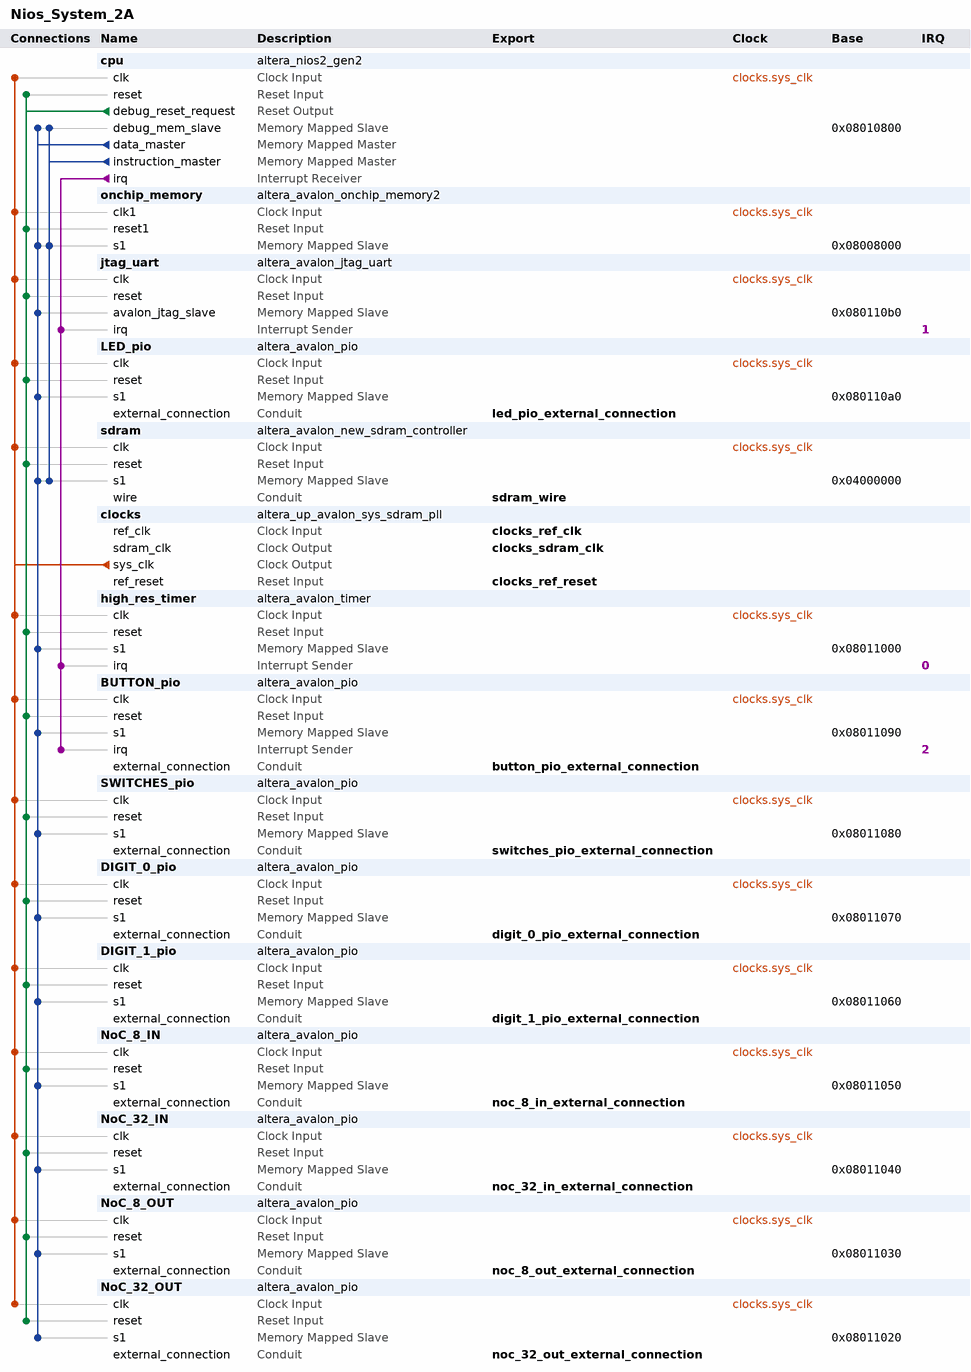
[diagram p0: system contents]
# Platform Designer (Qsys) system Nios_System_2A, Cyclone V 5CSEMA5F31C6
# Parameters at their usual value, and those the tool derives, are not listed.
package require -exact qsys 18.1
create_system Nios_System_2A
set_project_property DEVICE_FAMILY {Cyclone V}
set_project_property DEVICE 5CSEMA5F31C6

add_instance cpu altera_nios2_gen2 18.1
set_instance_parameter_value cpu cpuID 1
set_instance_parameter_value cpu dcache_size 8192
set_instance_parameter_value cpu exceptionSlave sdram.s1
set_instance_parameter_value cpu icache_size 4096
set_instance_parameter_value cpu impl Fast
set_instance_parameter_value cpu resetSlave sdram.s1

add_instance onchip_memory altera_avalon_onchip_memory2 18.1
set_instance_parameter_value onchip_memory dataWidth 32
set_instance_parameter_value onchip_memory dualPort false
set_instance_parameter_value onchip_memory initMemContent true
set_instance_parameter_value onchip_memory initializationFileName onchip_mem.hex
set_instance_parameter_value onchip_memory memorySize 20480

add_instance jtag_uart altera_avalon_jtag_uart 18.1
set_instance_parameter_value jtag_uart simInteractiveOptions NO_INTERACTIVE_WINDOWS

add_instance LED_pio altera_avalon_pio 18.1
set_instance_parameter_value LED_pio direction Output
set_instance_parameter_value LED_pio width 10

add_instance sdram altera_avalon_new_sdram_controller 18.1
set_instance_parameter_value sdram TAC 5.4
set_instance_parameter_value sdram TRCD 15.0
set_instance_parameter_value sdram TRP 15.0
set_instance_parameter_value sdram casLatency 3
set_instance_parameter_value sdram columnWidth 10
set_instance_parameter_value sdram dataWidth 16
set_instance_parameter_value sdram generateSimulationModel false
set_instance_parameter_value sdram model single_Micron_MT48LC4M32B2_7_chip
set_instance_parameter_value sdram numberOfBanks 4
set_instance_parameter_value sdram numberOfChipSelects 1
set_instance_parameter_value sdram powerUpDelay 100.0
set_instance_parameter_value sdram refreshPeriod 7.8125
set_instance_parameter_value sdram rowWidth 13

add_instance clocks altera_up_avalon_sys_sdram_pll 18.0
set_instance_parameter_value clocks CV_boards DE1-SoC
set_instance_parameter_value clocks gui_outclk 50.0
set_instance_parameter_value clocks gui_refclk 50.0

add_instance high_res_timer altera_avalon_timer 18.1
set_instance_parameter_value high_res_timer period 1
set_instance_parameter_value high_res_timer periodUnits MSEC

add_instance BUTTON_pio altera_avalon_pio 18.1
set_instance_parameter_value BUTTON_pio captureEdge true
set_instance_parameter_value BUTTON_pio direction Input
set_instance_parameter_value BUTTON_pio generateIRQ true
set_instance_parameter_value BUTTON_pio irqType EDGE
set_instance_parameter_value BUTTON_pio width 4

add_instance SWITCHES_pio altera_avalon_pio 18.1
set_instance_parameter_value SWITCHES_pio direction Input
set_instance_parameter_value SWITCHES_pio width 10

add_instance DIGIT_0_pio altera_avalon_pio 18.1
set_instance_parameter_value DIGIT_0_pio direction Output
set_instance_parameter_value DIGIT_0_pio width 7

add_instance DIGIT_1_pio altera_avalon_pio 18.1
set_instance_parameter_value DIGIT_1_pio direction Output
set_instance_parameter_value DIGIT_1_pio width 7

add_instance NoC_8_IN altera_avalon_pio 18.1
set_instance_parameter_value NoC_8_IN direction Input
set_instance_parameter_value NoC_8_IN width 8

add_instance NoC_32_IN altera_avalon_pio 18.1
set_instance_parameter_value NoC_32_IN direction Input
set_instance_parameter_value NoC_32_IN width 32

add_instance NoC_8_OUT altera_avalon_pio 18.1
set_instance_parameter_value NoC_8_OUT direction Output
set_instance_parameter_value NoC_8_OUT width 8

add_instance NoC_32_OUT altera_avalon_pio 18.1
set_instance_parameter_value NoC_32_OUT direction Output
set_instance_parameter_value NoC_32_OUT width 32

# connections
add_connection clocks.sys_clk BUTTON_pio.clk clock
add_connection clocks.sys_clk cpu.clk clock
add_connection clocks.sys_clk DIGIT_0_pio.clk clock
add_connection clocks.sys_clk DIGIT_1_pio.clk clock
add_connection clocks.sys_clk high_res_timer.clk clock
add_connection clocks.sys_clk jtag_uart.clk clock
add_connection clocks.sys_clk LED_pio.clk clock
add_connection clocks.sys_clk NoC_8_IN.clk clock
add_connection clocks.sys_clk NoC_8_OUT.clk clock
add_connection clocks.sys_clk NoC_32_IN.clk clock
add_connection clocks.sys_clk NoC_32_OUT.clk clock
add_connection clocks.sys_clk onchip_memory.clk1 clock
add_connection clocks.sys_clk sdram.clk clock
add_connection clocks.sys_clk SWITCHES_pio.clk clock
add_connection cpu.debug_reset_request BUTTON_pio.reset reset
add_connection cpu.debug_reset_request cpu.reset reset
add_connection cpu.debug_reset_request DIGIT_0_pio.reset reset
add_connection cpu.debug_reset_request DIGIT_1_pio.reset reset
add_connection cpu.debug_reset_request high_res_timer.reset reset
add_connection cpu.debug_reset_request jtag_uart.reset reset
add_connection cpu.debug_reset_request LED_pio.reset reset
add_connection cpu.debug_reset_request NoC_8_IN.reset reset
add_connection cpu.debug_reset_request NoC_8_OUT.reset reset
add_connection cpu.debug_reset_request NoC_32_IN.reset reset
add_connection cpu.debug_reset_request NoC_32_OUT.reset reset
add_connection cpu.debug_reset_request onchip_memory.reset1 reset
add_connection cpu.debug_reset_request sdram.reset reset
add_connection cpu.debug_reset_request SWITCHES_pio.reset reset
add_connection cpu.data_master BUTTON_pio.s1 avalon
set_connection_parameter_value cpu.data_master/BUTTON_pio.s1 baseAddress 0x08011090
add_connection cpu.data_master cpu.debug_mem_slave avalon
set_connection_parameter_value cpu.data_master/cpu.debug_mem_slave baseAddress 0x08010800
add_connection cpu.data_master DIGIT_0_pio.s1 avalon
set_connection_parameter_value cpu.data_master/DIGIT_0_pio.s1 baseAddress 0x08011070
add_connection cpu.data_master DIGIT_1_pio.s1 avalon
set_connection_parameter_value cpu.data_master/DIGIT_1_pio.s1 baseAddress 0x08011060
add_connection cpu.data_master high_res_timer.s1 avalon
set_connection_parameter_value cpu.data_master/high_res_timer.s1 baseAddress 0x08011000
add_connection cpu.data_master jtag_uart.avalon_jtag_slave avalon
set_connection_parameter_value cpu.data_master/jtag_uart.avalon_jtag_slave baseAddress 0x080110b0
add_connection cpu.data_master LED_pio.s1 avalon
set_connection_parameter_value cpu.data_master/LED_pio.s1 baseAddress 0x080110a0
add_connection cpu.data_master NoC_8_IN.s1 avalon
set_connection_parameter_value cpu.data_master/NoC_8_IN.s1 baseAddress 0x08011050
add_connection cpu.data_master NoC_8_OUT.s1 avalon
set_connection_parameter_value cpu.data_master/NoC_8_OUT.s1 baseAddress 0x08011030
add_connection cpu.data_master NoC_32_IN.s1 avalon
set_connection_parameter_value cpu.data_master/NoC_32_IN.s1 baseAddress 0x08011040
add_connection cpu.data_master NoC_32_OUT.s1 avalon
set_connection_parameter_value cpu.data_master/NoC_32_OUT.s1 baseAddress 0x08011020
add_connection cpu.data_master onchip_memory.s1 avalon
set_connection_parameter_value cpu.data_master/onchip_memory.s1 baseAddress 0x08008000
add_connection cpu.data_master sdram.s1 avalon
set_connection_parameter_value cpu.data_master/sdram.s1 baseAddress 0x04000000
add_connection cpu.data_master SWITCHES_pio.s1 avalon
set_connection_parameter_value cpu.data_master/SWITCHES_pio.s1 baseAddress 0x08011080
add_connection cpu.instruction_master cpu.debug_mem_slave avalon
set_connection_parameter_value cpu.instruction_master/cpu.debug_mem_slave baseAddress 0x08010800
add_connection cpu.instruction_master onchip_memory.s1 avalon
set_connection_parameter_value cpu.instruction_master/onchip_memory.s1 baseAddress 0x08008000
add_connection cpu.instruction_master sdram.s1 avalon
set_connection_parameter_value cpu.instruction_master/sdram.s1 baseAddress 0x04000000
add_connection cpu.irq BUTTON_pio.irq interrupt
set_connection_parameter_value cpu.irq/BUTTON_pio.irq irqNumber 2
add_connection cpu.irq high_res_timer.irq interrupt
set_connection_parameter_value cpu.irq/high_res_timer.irq irqNumber 0
add_connection cpu.irq jtag_uart.irq interrupt
set_connection_parameter_value cpu.irq/jtag_uart.irq irqNumber 1

# exported interfaces
add_interface button_pio_external_connection conduit end
set_interface_property button_pio_external_connection EXPORT_OF BUTTON_pio.external_connection
add_interface clocks_ref_clk clock sink
set_interface_property clocks_ref_clk EXPORT_OF clocks.ref_clk
add_interface clocks_ref_reset reset sink
set_interface_property clocks_ref_reset EXPORT_OF clocks.ref_reset
add_interface clocks_sdram_clk clock source
set_interface_property clocks_sdram_clk EXPORT_OF clocks.sdram_clk
add_interface digit_0_pio_external_connection conduit end
set_interface_property digit_0_pio_external_connection EXPORT_OF DIGIT_0_pio.external_connection
add_interface digit_1_pio_external_connection conduit end
set_interface_property digit_1_pio_external_connection EXPORT_OF DIGIT_1_pio.external_connection
add_interface led_pio_external_connection conduit end
set_interface_property led_pio_external_connection EXPORT_OF LED_pio.external_connection
add_interface noc_32_in_external_connection conduit end
set_interface_property noc_32_in_external_connection EXPORT_OF NoC_32_IN.external_connection
add_interface noc_32_out_external_connection conduit end
set_interface_property noc_32_out_external_connection EXPORT_OF NoC_32_OUT.external_connection
add_interface noc_8_in_external_connection conduit end
set_interface_property noc_8_in_external_connection EXPORT_OF NoC_8_IN.external_connection
add_interface noc_8_out_external_connection conduit end
set_interface_property noc_8_out_external_connection EXPORT_OF NoC_8_OUT.external_connection
add_interface sdram_wire conduit end
set_interface_property sdram_wire EXPORT_OF sdram.wire
add_interface switches_pio_external_connection conduit end
set_interface_property switches_pio_external_connection EXPORT_OF SWITCHES_pio.external_connection

set_interconnect_requirement {$system} qsys_mm.clockCrossingAdapter HANDSHAKE
set_interconnect_requirement {$system} qsys_mm.enableEccProtection FALSE
set_interconnect_requirement {$system} qsys_mm.insertDefaultSlave FALSE
set_interconnect_requirement {$system} qsys_mm.maxAdditionalLatency 1

save_system Nios_System_2A.qsys
